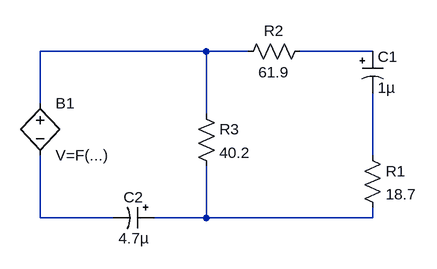
[diagram p0: schematic Draft1.asc]
Draft1.asc, the LTspice schematic file:
Version 4
SHEET 1 880 680
WIRE 240 48 -16 48
WIRE 304 48 240 48
WIRE 496 48 384 48
WIRE -16 128 -16 48
WIRE 240 144 240 48
WIRE 496 208 496 112
WIRE -16 304 -16 208
WIRE 96 304 -16 304
WIRE 240 304 240 224
WIRE 240 304 160 304
WIRE 496 304 496 288
WIRE 496 304 240 304
SYMBOL res 480 192 R0
SYMATTR InstName R1
SYMATTR Value 18.7
SYMATTR SpiceLine tol=1 pwr=0.1
SYMBOL res 400 32 R90
WINDOW 0 0 56 VBottom 2
WINDOW 3 32 56 VTop 2
SYMATTR InstName R2
SYMATTR Value 61.9
SYMATTR SpiceLine tol=1 pwr=0.1
SYMBOL res 224 128 R0
SYMATTR InstName R3
SYMATTR Value 40.2
SYMATTR SpiceLine tol=1 pwr=0.1
SYMBOL polcap 480 48 R0
WINDOW 3 24 56 Left 2
SYMATTR InstName C1
SYMATTR Value 1µ
SYMATTR Description Capacitor
SYMATTR Type cap
SYMATTR SpiceLine V=16 Irms=0 Rser=11 Lser=0 mfg="AVX" pn="TAJA105K016" type="Tantalum"
SYMBOL polcap 160 288 R90
WINDOW 0 0 32 VBottom 2
WINDOW 3 32 32 VTop 2
SYMATTR InstName C2
SYMATTR Value 4.7µ
SYMATTR Description Capacitor
SYMATTR Type cap
SYMATTR SpiceLine V=16 Irms=0 Rser=4 Lser=0 mfg="AVX" pn="TAJA475M016" type="Tantalum"
SYMBOL bv -16 112 R0
SYMATTR InstName B1

The netlist it stands for:
* Draft1.asc
R1 N003 N005 18.7 tol=1 pwr=0.1
R2 N002 N001 61.9 tol=1 pwr=0.1
R3 N001 N005 40.2 tol=1 pwr=0.1
C1 N002 N003 1µ V=16 Irms=0 Rser=11 Lser=0 mfg="AVX" pn="TAJA105K016" type="Tantalum"
C2 N005 N004 4.7µ V=16 Irms=0 Rser=4 Lser=0 mfg="AVX" pn="TAJA475M016" type="Tantalum"
B1 N001 N004 V=F(...)
.backanno
.end